# EAGLE schematic Motherboard_simple (EAGLE 6.4)
DATABASE: ./../../../eagle/PARTSDB.TXT
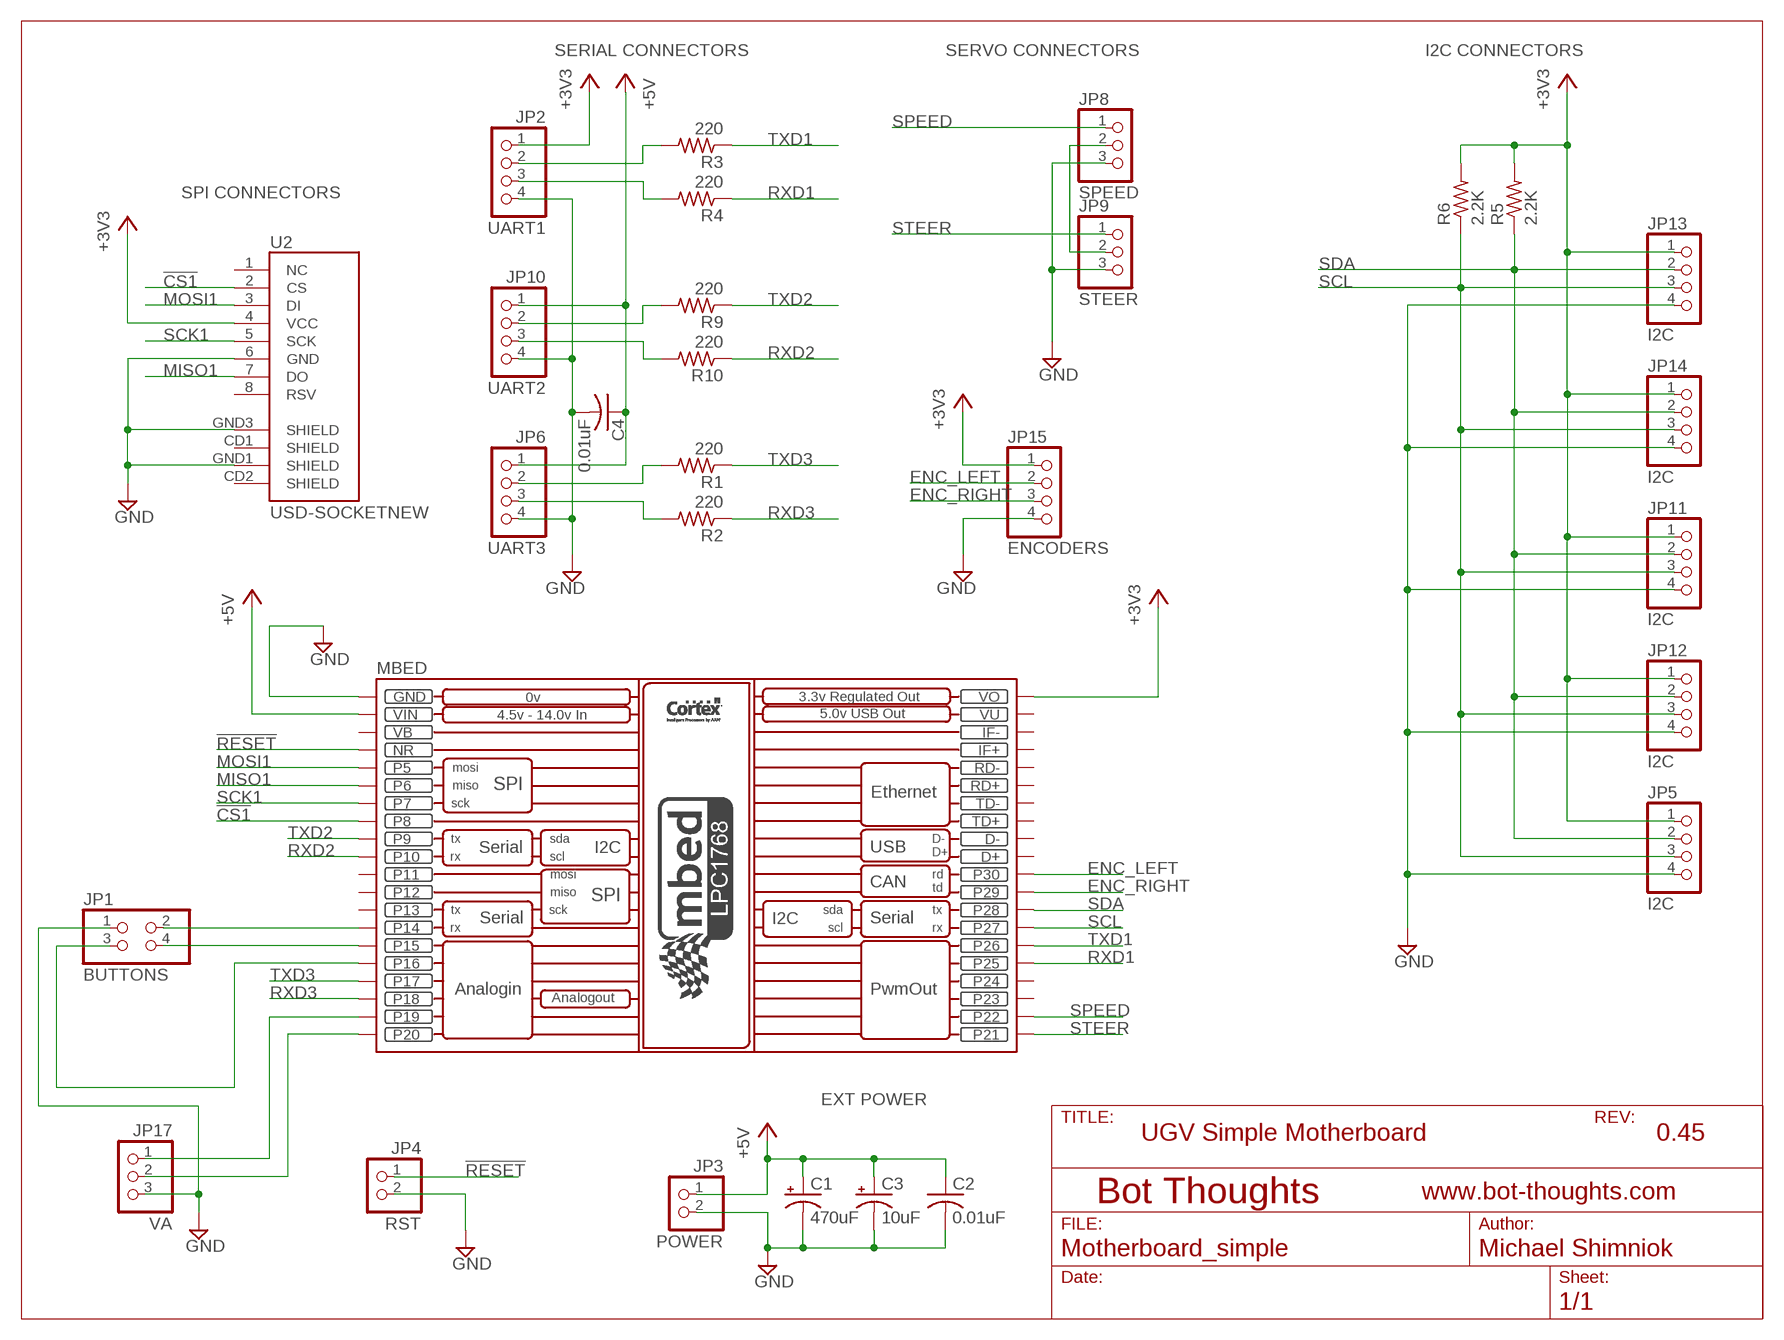
[diagram p0: schematic, sheet 1]

## Parts
C1  470uF  CPOL-USE2.5-6  [E2,5-6]
C2  0.01uF  C-US050-025X075  [C050-025X075]
C3  10uF  CPOL-USE2.5-6  [E2,5-6]
C4  0.01uF  C-US050-025X075  [C050-025X075]
JP1  BUTTONS  PINHD-2X02_2.54  [2X02]
JP2  UART1  PINHD-1X04_2.54-S  [1X04-S]
JP3  POWER  PINHD-1X02_2.54-S  [1X02-S]
JP4  RST  PINHD-1X02_2.54-S  [1X02-S]
JP5  I2C  PINHD-1X04_2.54-S  [1X04-S]
JP6  UART3  PINHD-1X04_2.54-S  [1X04-S]
JP8  SPEED  PINHD-1X03_2.54-S  [1X03-S]
JP9  STEER  PINHD-1X03_2.54-S  [1X03-S]
JP10  UART2  PINHD-1X04_2.54-S  [1X04-S]
JP11  I2C  PINHD-1X04_2.54-S  [1X04-S]
JP12  I2C  PINHD-1X04_2.54-S  [1X04-S]
JP13  I2C  PINHD-1X04_2.54-S  [1X04-S]
JP14  I2C  PINHD-1X04_2.54-S  [1X04-S]
JP15  ENCODERS  PINHD-1X04_2.54-S  [1X04-S]
JP17  VA  PINHD-1X03_2.54-S  [1X03-S]
MBED  MBED_NXP_LPC1768  [MBED-KIT]
R1  220  R-US_0204/5  [0204/5]
R2  220  R-US_0204/5  [0204/5]
R3  220  R-US_0204/5  [0204/5]
R4  220  R-US_0204/5  [0204/5]
R5  2.2K  R-US_0204/5  [0204/5]
R6  2.2K  R-US_0204/5  [0204/5]
R9  220  R-US_0204/5  [0204/5]
R10  220  R-US_0204/5  [0204/5]
U2  USD-SOCKETNEW  [MICRO-SD-SOCKET-PP]

## Nets
!CS1: MBED.P$8(P8) U2.2(CS)
!RESET: JP4.1 MBED.NR
+3V3: JP2.1 JP5.1 JP11.1 JP12.1 JP13.1 JP14.1 JP15.1 MBED.VOUT(VO) R5.2 R6.2 U2.4(VCC)
+5V: C1.+ C2.1 C3.+ C4.1 JP3.1 JP6.1 JP10.1 MBED.VIN
AMP: JP17.2 MBED.P$20(P20)
ENC_LEFT: JP15.2 MBED.P$30(P30)
ENC_RIGHT: JP15.3 MBED.P$29(P29)
GND: C1.- C2.2 C3.- C4.2 JP1.1 JP2.4 JP3.2 JP4.2 JP5.4 JP6.4 JP8.3 JP9.3 JP10.4 JP11.4 JP12.4 JP13.4 JP14.4 JP15.4 JP17.3 MBED.GND U2.6(GND) U2.GND1(SHIELD) U2.GND3(SHIELD)
MISO1: MBED.P$6(P6) U2.7(DO)
MOSI1: MBED.P$5(P5) U2.3(DI)
N$1: JP6.2 R1.2
N$2: JP6.3 R2.2
N$3: JP8.2 JP9.2
N$5: JP1.2 MBED.P$14(P14)
N$6: JP17.1 MBED.P$19(P19)
N$7: JP1.4 MBED.P$15(P15)
N$8: JP1.3 MBED.P$16(P16)
N$9: JP2.2 R3.2
N$10: JP2.3 R4.2
N$16: JP10.2 R9.2
N$17: JP10.3 R10.2
RXD1: MBED.P$25(P25) R4.1
RXD2: MBED.P$10(P10) R10.1
RXD3: MBED.P$18(P18) R2.1
SCK1: MBED.P$7(P7) U2.5(SCK)
SCL: JP5.3 JP11.3 JP12.3 JP13.3 JP14.3 MBED.P$27(P27) R6.1
SDA: JP5.2 JP11.2 JP12.2 JP13.2 JP14.2 MBED.P$28(P28) R5.1
SPEED: JP8.1 MBED.P$22(P22)
STEER: JP9.1 MBED.P$21(P21)
TXD1: MBED.P$26(P26) R3.1
TXD2: MBED.P$9(P9) R9.1
TXD3: MBED.P$17(P17) R1.1
Unconnected: MBED.D+ MBED.D- MBED.IF+ MBED.IF- MBED.P$11(P11) MBED.P$12(P12) MBED.P$13(P13) MBED.P$23(P23) MBED.P$24(P24) MBED.RD+ MBED.RD- MBED.TD+ MBED.TD- U2.1(NC) U2.8(RSV) U2.CD1(SHIELD) U2.CD2(SHIELD)

## Notes on the sheet
- SERIAL CONNECTORS | SERVO CONNECTORS | I2C CONNECTORS
- SPI CONNECTORS
- EXT POWER
- UGV Simple Motherboard | 0.45

## Power pins joined to a net without a drawn wire
VB: MBED.VB
VU: MBED.VU

## Library data of the parts
C1 C3 = rcl:CPOL-US: POLARIZED CAPACITOR, American symbol
C2 C4 = rcl:C-US: CAPACITOR, American symbol
JP1 = pinhead-2:PINHD-2X02: PIN HEADER
JP2 JP5 JP6 JP10-JP15 = pinhead-2:PINHD-1X04: PIN HEADER; OC_NEWARK: unknown
JP3 JP4 = pinhead-2:PINHD-1X02: PIN HEADER; OC_NEWARK: unknown
JP8 JP9 JP17 = pinhead-2:PINHD-1X03: PIN HEADER; OC_NEWARK: unknown
MBED = MBED_v2.1:MBED_NXP_LPC1768: Mbed LPC1768 - ARM CORTEX v2.1 * Schematic symbol is now placed in eagles's default raster. *The pads diameter are suitable for routing between mbed pins * mbed pads are 0.8 mm drill diameter. --------------------------------------------- Created by: Mohamed Yousry *Alexandria, Egypt *Email: mohamed.yousry@ieeegoldegypt.org; MPN: 2212S-20SG-85; OC_NEWARK: 08N6778
R1-R4 R9 R10 = rcl:R-US_: RESISTOR, American symbol; MPN: WCR0805-220RFI; OC_NEWARK: 98K2621
R5 R6 = rcl:R-US_: RESISTOR, American symbol; OC_NEWARK: unknown
U2 = SparkFun:USD-SOCKET: microSD Socket Push-push type uSD socket. Schematic element and footprint production proven. Spark Fun Electronics SKU : PRT-00127. tDoc lines correctly indicate media card edge positions when inserting (unlocked, locked, depressed).